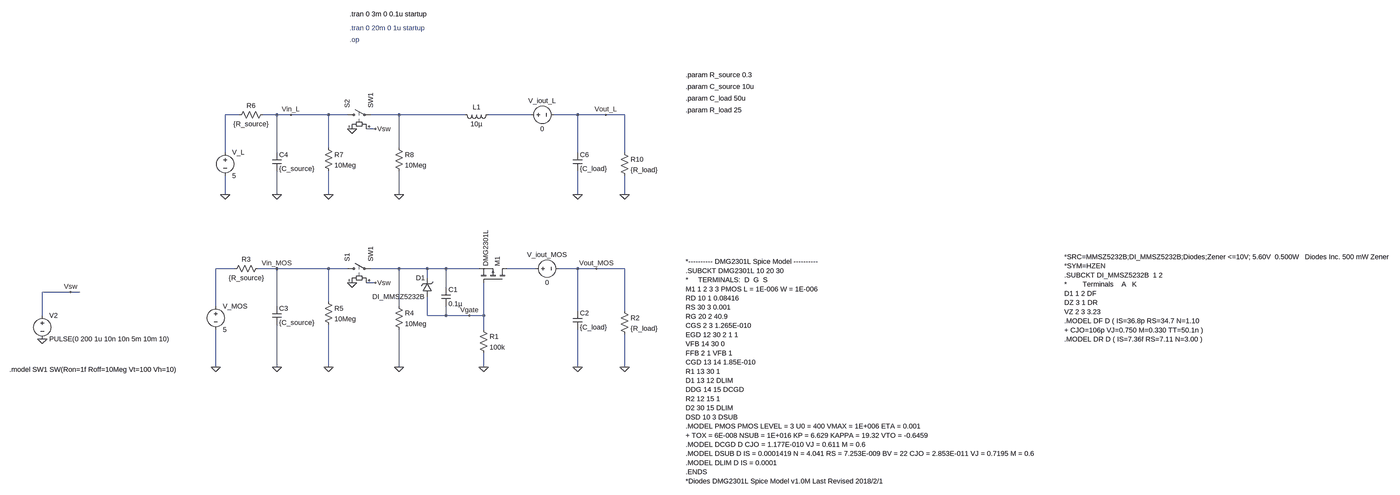
[diagram p0: schematic inrush_current_limiter.asc, whole sheet]
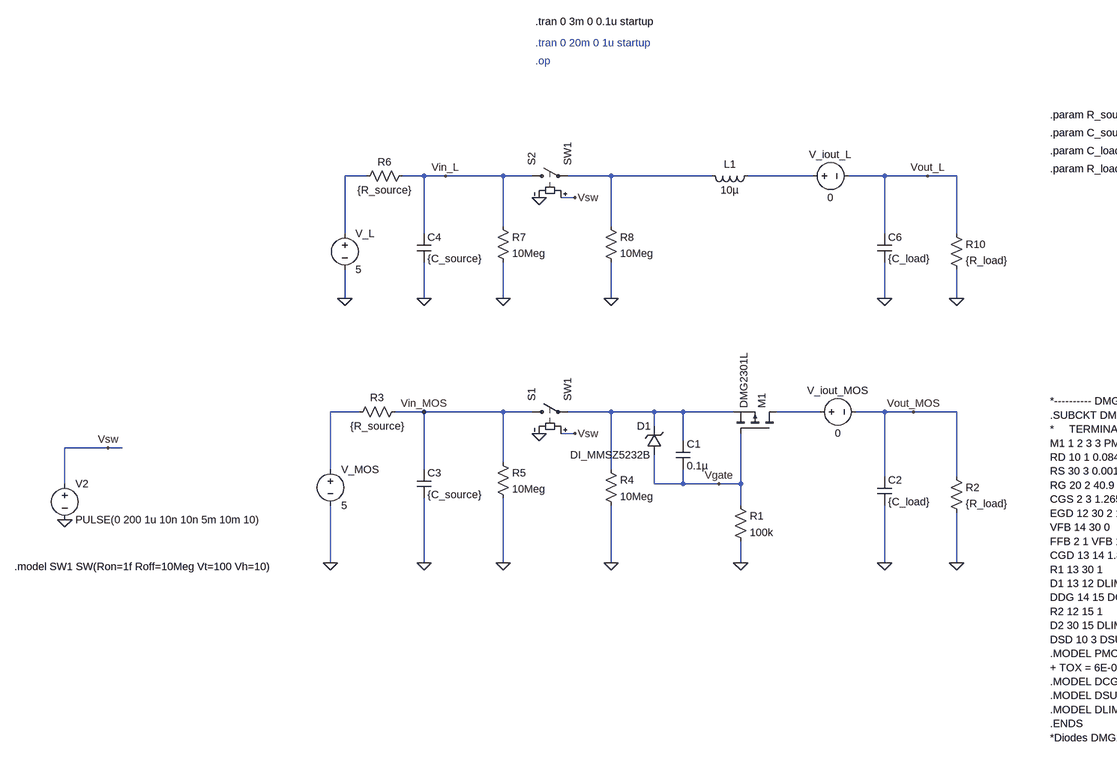
[diagram p1: schematic inrush_current_limiter.asc, part, row 1 of 1, column 1 of 2]
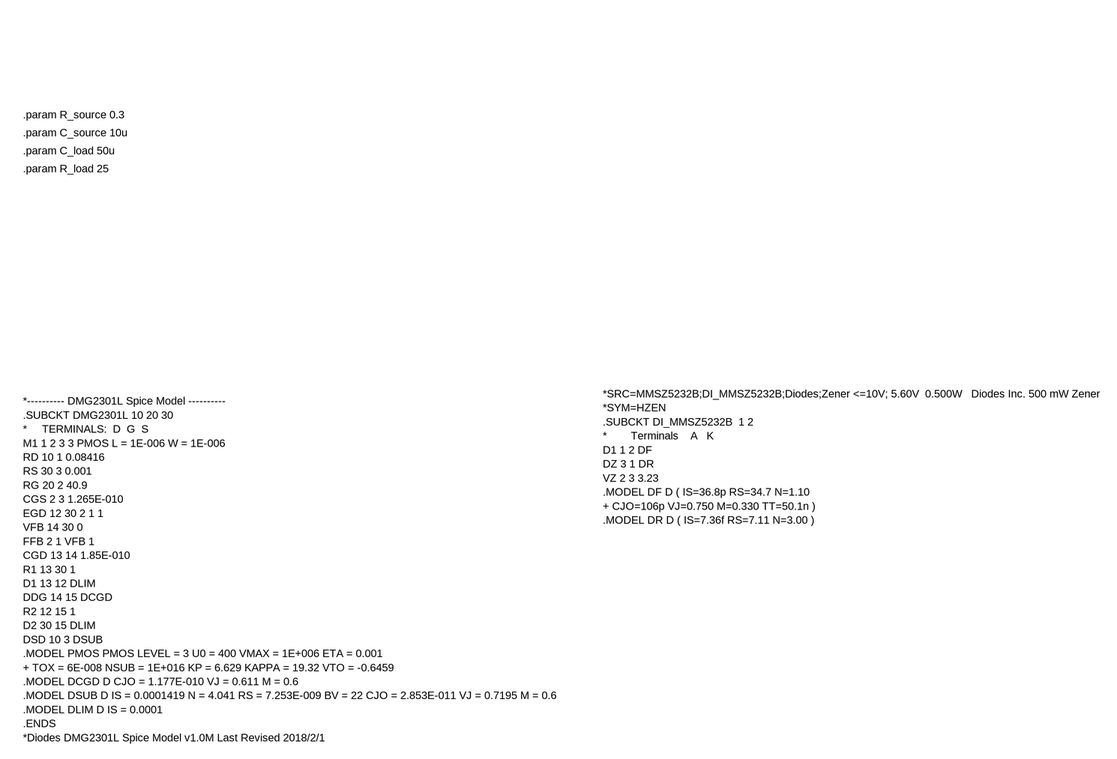
[diagram p2: schematic inrush_current_limiter.asc, part, row 1 of 1, column 2 of 2]
inrush_current_limiter.asc, the LTspice schematic file:
Version 4
SHEET 1 3636 680
WIRE -528 -544 -576 -544
WIRE -400 -544 -448 -544
WIRE -352 -544 -400 -544
WIRE -224 -544 -352 -544
WIRE -160 -544 -224 -544
WIRE 16 -544 -80 -544
WIRE 240 -544 16 -544
WIRE 464 -544 320 -544
WIRE 624 -544 544 -544
WIRE 720 -544 624 -544
WIRE 784 -544 720 -544
WIRE -64 -496 -96 -496
WIRE -224 -432 -224 -544
WIRE 16 -432 16 -544
WIRE -576 -416 -576 -544
WIRE -400 -416 -400 -544
WIRE 624 -416 624 -544
WIRE 784 -416 784 -544
WIRE -576 -272 -576 -336
WIRE -400 -272 -400 -352
WIRE -224 -272 -224 -352
WIRE 16 -272 16 -352
WIRE 624 -272 624 -352
WIRE 784 -272 784 -336
WIRE -544 -16 -608 -16
WIRE -400 -16 -464 -16
WIRE -224 -16 -400 -16
WIRE -160 -16 -224 -16
WIRE 16 -16 -80 -16
WIRE 112 -16 16 -16
WIRE 176 -16 112 -16
WIRE 288 -16 176 -16
WIRE 480 -16 384 -16
WIRE 624 -16 560 -16
WIRE 688 -16 624 -16
WIRE 784 -16 688 -16
WIRE 112 16 112 -16
WIRE -64 32 -96 32
WIRE 176 48 176 -16
WIRE -1136 64 -1232 64
WIRE -1104 64 -1136 64
WIRE -224 96 -224 -16
WIRE -608 112 -608 -16
WIRE -400 112 -400 -16
WIRE 16 112 16 -16
WIRE 624 128 624 -16
WIRE 784 128 784 -16
WIRE -1232 144 -1232 64
WIRE 112 144 112 80
WIRE 176 144 176 112
WIRE 176 144 112 144
WIRE 256 144 176 144
WIRE 304 144 304 32
WIRE 304 144 256 144
WIRE 304 192 304 144
WIRE -608 320 -608 192
WIRE -400 320 -400 176
WIRE -224 320 -224 176
WIRE 16 320 16 192
WIRE 304 320 304 272
WIRE 624 320 624 192
WIRE 784 320 784 208
FLAG 304 320 0
FLAG 624 320 0
FLAG -400 320 0
FLAG -400 -16 Vin_MOS
FLAG 688 -16 Vout_MOS
FLAG -608 320 0
FLAG -1232 224 0
FLAG -1136 64 Vsw
FLAG 784 320 0
FLAG 256 144 Vgate
FLAG 16 320 0
FLAG -224 320 0
FLAG -576 -272 0
FLAG -400 -272 0
FLAG -224 -272 0
FLAG 16 -272 0
FLAG 624 -272 0
FLAG 784 -272 0
FLAG 720 -544 Vout_L
FLAG -352 -544 Vin_L
FLAG -144 -496 0
FLAG -64 -496 Vsw
FLAG -144 32 0
FLAG -64 32 Vsw
SYMBOL res 288 176 R0
SYMATTR InstName R1
SYMATTR Value 100k
SYMBOL cap 160 48 R0
SYMATTR InstName C1
SYMATTR Value 0.1µ
SYMBOL cap 608 128 R0
SYMATTR InstName C2
SYMATTR Value {C_load}
SYMBOL cap -416 112 R0
SYMATTR InstName C3
SYMATTR Value {C_source}
SYMBOL voltage -608 96 R0
WINDOW 123 0 0 Left 0
WINDOW 39 0 0 Left 0
SYMATTR InstName V_MOS
SYMATTR Value 5
SYMBOL voltage -1232 128 R0
WINDOW 123 0 0 Left 0
WINDOW 39 0 0 Left 0
SYMATTR InstName V2
SYMATTR Value PULSE(0 200 1u 10n 10n 5m 10m 10)
SYMBOL res 768 112 R0
SYMATTR InstName R2
SYMATTR Value {R_load}
SYMBOL pmos 384 32 M270
SYMATTR InstName M1
SYMATTR Value DMG2301L
SYMATTR Prefix X
SYMBOL res -448 -32 R90
WINDOW 0 0 56 VBottom 2
WINDOW 3 32 56 VTop 2
SYMATTR InstName R3
SYMATTR Value {R_source}
SYMBOL voltage 464 -16 R270
WINDOW 0 32 56 VTop 2
WINDOW 3 -32 56 VBottom 2
SYMATTR InstName V_iout_MOS
SYMATTR Value 0
SYMBOL res 0 96 R0
SYMATTR InstName R4
SYMATTR Value 10Meg
SYMBOL res -240 80 R0
SYMATTR InstName R5
SYMATTR Value 10Meg
SYMBOL voltage -576 -432 R0
WINDOW 123 0 0 Left 0
WINDOW 39 0 0 Left 0
SYMATTR InstName V_L
SYMATTR Value 5
SYMBOL res -432 -560 R90
WINDOW 0 0 56 VBottom 2
WINDOW 3 32 56 VTop 2
SYMATTR InstName R6
SYMATTR Value {R_source}
SYMBOL cap -416 -416 R0
SYMATTR InstName C4
SYMATTR Value {C_source}
SYMBOL res -240 -448 R0
SYMATTR InstName R7
SYMATTR Value 10Meg
SYMBOL res 0 -448 R0
SYMATTR InstName R8
SYMATTR Value 10Meg
SYMBOL voltage 448 -544 R270
WINDOW 0 32 56 VTop 2
WINDOW 3 -32 56 VBottom 2
SYMATTR InstName V_iout_L
SYMATTR Value 0
SYMBOL cap 608 -416 R0
SYMATTR InstName C6
SYMATTR Value {C_load}
SYMBOL res 768 -432 R0
SYMATTR InstName R10
SYMATTR Value {R_load}
SYMBOL ind 336 -560 R90
WINDOW 0 5 56 VBottom 2
WINDOW 3 32 56 VTop 2
SYMATTR InstName L1
SYMATTR Value 10µ
SYMBOL sw -176 -544 R270
SYMATTR InstName S2
SYMATTR Value SW1
SYMBOL zener 128 80 R180
WINDOW 0 24 64 Left 2
WINDOW 3 24 0 Left 2
SYMATTR InstName D1
SYMATTR Value DI_MMSZ5232B
SYMATTR Prefix X
SYMBOL sw -176 -16 R270
SYMATTR InstName S1
SYMATTR Value SW1
TEXT -152 -840 Left 2 ;.tran 0 20m 0 1u startup
TEXT -1344 328 Left 2 !.model SW1 SW(Ron=1f Roff=10Meg Vt=100 Vh=10)
TEXT 992 -40 Left 2 !*---------- DMG2301L Spice Model ----------\n.SUBCKT DMG2301L 10 20 30 \n*     TERMINALS:  D  G  S\nM1 1 2 3 3 PMOS L = 1E-006 W = 1E-006 \nRD 10 1 0.08416 \nRS 30 3 0.001 \nRG 20 2 40.9 \nCGS 2 3 1.265E-010 \nEGD 12 30 2 1 1 \nVFB 14 30 0 \nFFB 2 1 VFB 1 \nCGD 13 14 1.85E-010 \nR1 13 30 1 \nD1 13 12 DLIM \nDDG 14 15 DCGD \nR2 12 15 1 \nD2 30 15 DLIM \nDSD 10 3 DSUB \n.MODEL PMOS PMOS LEVEL = 3 U0 = 400 VMAX = 1E+006 ETA = 0.001 \n+ TOX = 6E-008 NSUB = 1E+016 KP = 6.629 KAPPA = 19.32 VTO = -0.6459 \n.MODEL DCGD D CJO = 1.177E-010 VJ = 0.611 M = 0.6 \n.MODEL DSUB D IS = 0.0001419 N = 4.041 RS = 7.253E-009 BV = 22 CJO = 2.853E-011 VJ = 0.7195 M = 0.6 \n.MODEL DLIM D IS = 0.0001 \n.ENDS\n*Diodes DMG2301L Spice Model v1.0M Last Revised 2018/2/1
TEXT -152 -800 Left 2 ;.op
TEXT -152 -888 Left 2 !.tran 0 3m 0 0.1u startup
TEXT 992 -600 Left 2 !.param C_load 50u
TEXT 992 -560 Left 2 !.param R_load 25
TEXT 992 -680 Left 2 !.param R_source 0.3
TEXT 992 -640 Left 2 !.param C_source 10u
TEXT 2456 -56 Left 2 !*SRC=MMSZ5232B;DI_MMSZ5232B;Diodes;Zener <=10V; 5.60V  0.500W   Diodes Inc. 500 mW Zener\n*SYM=HZEN\n.SUBCKT DI_MMSZ5232B  1 2\n*        Terminals    A   K\nD1 1 2 DF\nDZ 3 1 DR\nVZ 2 3 3.23\n.MODEL DF D ( IS=36.8p RS=34.7 N=1.10\n+ CJO=106p VJ=0.750 M=0.330 TT=50.1n )\n.MODEL DR D ( IS=7.36f RS=7.11 N=3.00 )

The netlist it stands for:
* inrush_current_limiter.asc
R1 Vgate 0 100k
C1 N005 Vgate 0.1µ
C2 Vout_MOS 0 {C_load}
C3 Vin_MOS 0 {C_source}
V_MOS N004 0 5
V2 Vsw 0 PULSE(0 200 1u 10n 10n 5m 10m 10)
R2 Vout_MOS 0 {R_load}
XM1 N006 Vgate N005 DMG2301L  ; pins D G S
R3 Vin_MOS N004 {R_source}
V_iout_MOS N006 Vout_MOS 0
R4 N005 0 10Meg
R5 Vin_MOS 0 10Meg
V_L N001 0 5
R6 Vin_L N001 {R_source}
C4 Vin_L 0 {C_source}
R7 Vin_L 0 10Meg
R8 N002 0 10Meg
V_iout_L N003 Vout_L 0
C6 Vout_L 0 {C_load}
R10 Vout_L 0 {R_load}
L1 N003 N002 10µ
S2 Vin_L N002 Vsw 0 SW1
XD1 Vgate N005 DI_MMSZ5232B  ; pins + -
S1 Vin_MOS N005 Vsw 0 SW1
* .tran 0 20m 0 1u startup
.model SW1 SW(Ron=1f Roff=10Meg Vt=100 Vh=10)
*---------- DMG2301L Spice Model ----------
.SUBCKT DMG2301L 10 20 30
*     TERMINALS:  D  G  S
M1 1 2 3 3 PMOS L = 1E-006 W = 1E-006
RD 10 1 0.08416
RS 30 3 0.001
RG 20 2 40.9
CGS 2 3 1.265E-010
EGD 12 30 2 1 1
VFB 14 30 0
FFB 2 1 VFB 1
CGD 13 14 1.85E-010
R1 13 30 1
D1 13 12 DLIM
DDG 14 15 DCGD
R2 12 15 1
D2 30 15 DLIM
DSD 10 3 DSUB
.MODEL PMOS PMOS LEVEL = 3 U0 = 400 VMAX = 1E+006 ETA = 0.001
+ TOX = 6E-008 NSUB = 1E+016 KP = 6.629 KAPPA = 19.32 VTO = -0.6459
.MODEL DCGD D CJO = 1.177E-010 VJ = 0.611 M = 0.6
.MODEL DSUB D IS = 0.0001419 N = 4.041 RS = 7.253E-009 BV = 22 CJO = 2.853E-011 VJ = 0.7195 M = 0.6
.MODEL DLIM D IS = 0.0001
.ENDS
*Diodes DMG2301L Spice Model v1.0M Last Revised 2018/2/1
* .op
.tran 0 3m 0 0.1u startup
.param C_load 50u
.param R_load 25
.param R_source 0.3
.param C_source 10u
*SRC=MMSZ5232B;DI_MMSZ5232B;Diodes;Zener <=10V; 5.60V  0.500W   Diodes Inc. 500 mW Zener
*SYM=HZEN
.SUBCKT DI_MMSZ5232B  1 2
*        Terminals    A   K
D1 1 2 DF
DZ 3 1 DR
VZ 2 3 3.23
.MODEL DF D ( IS=36.8p RS=34.7 N=1.10
+ CJO=106p VJ=0.750 M=0.330 TT=50.1n )
.MODEL DR D ( IS=7.36f RS=7.11 N=3.00 )
.backanno
.end

* Results of the author's LTspice run, read from the files saved beside the schematic
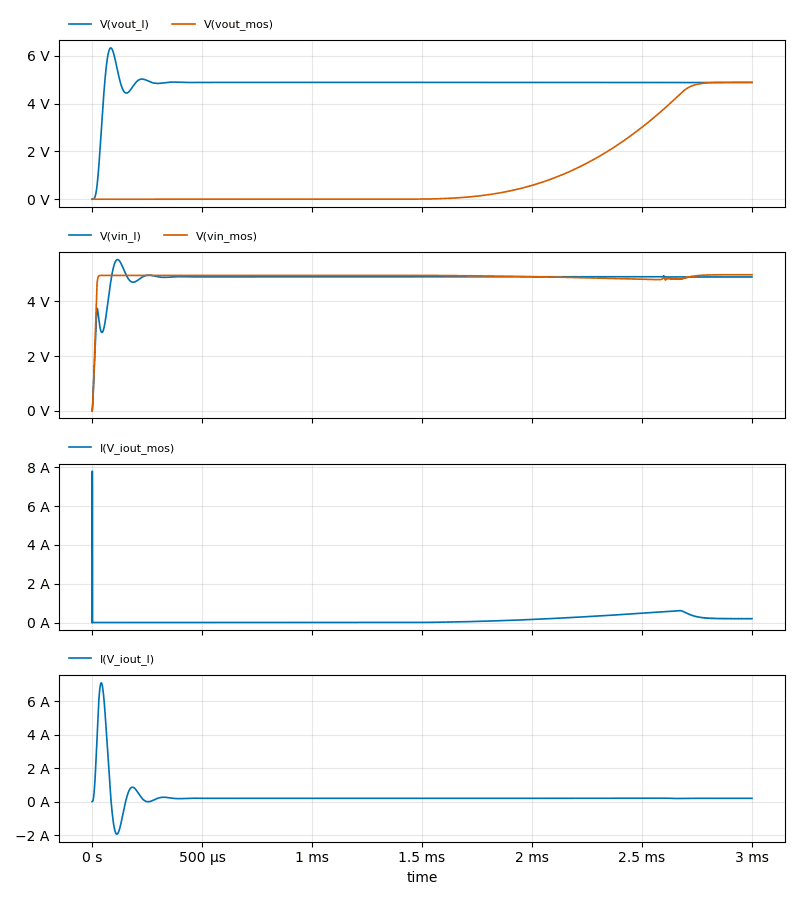
[diagram p3: Transient Analysis of inrush_current_limiter.asc, plotted from the saved traces]
* Transient Analysis, 1 run:
*   V(vout_l): min 0 V, max 6.33 V, average 4.841 V, rms 4.869 V, last 4.883 V
*   V(vout_mos): min 0 V, max 4.896 V, average 1.037 V, rms 1.963 V, last 4.896 V
*   V(vin_l): min 0 V, max 5.517 V, average 4.842 V, rms 4.855 V, last 4.883 V
*   V(vin_mos): min 0 V, max 4.967 V, average 4.893 V, rms 4.901 V, last 4.965 V
*   I(V_iout_mos): min 0 A, max 7.803 A, average 123.1 mA, rms 212.1 mA, last 198.2 mA
*   I(V_iout_l): min -1.949 A, max 7.107 A, average 275 mA, rms 820.7 mA, last 195.3 mA